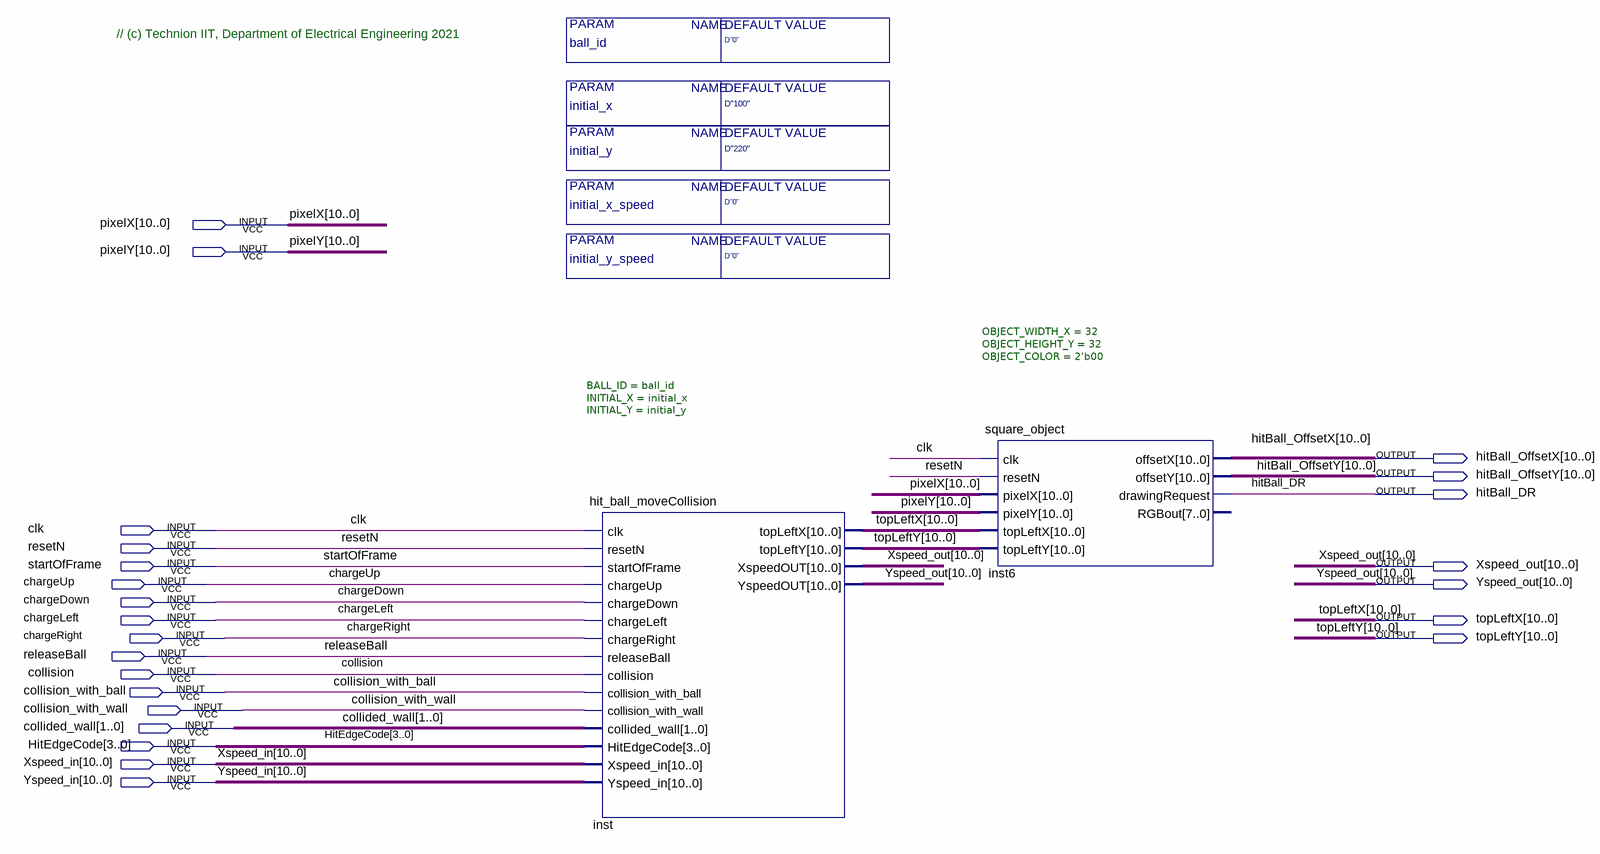
[diagram p0: schematic sheet]
// Quartus schematic HitBall_Block.bdf as structural Verilog: 2 symbols, 24 pins
module HitBall_Block #(parameter initial_x = "D\"100\"", parameter initial_y = "D\"220\"", parameter initial_x_speed = "D\"0\"", parameter initial_y_speed = "D\"0\"", parameter ball_id = "D\"0\"") (
  input  [10:0] pixelX,
  input  [10:0] pixelY,
  input  clk,
  input  resetN,
  input  startOfFrame,
  input  chargeUp,
  input  chargeDown,
  input  chargeLeft,
  input  chargeRight,
  input  releaseBall,
  input  collision,
  input  collision_with_ball,
  input  collision_with_wall,
  input  [1:0] collided_wall,
  input  [3:0] HitEdgeCode,
  input  [10:0] Xspeed_in,
  input  [10:0] Yspeed_in,
  output [10:0] hitBall_OffsetX,
  output [10:0] hitBall_OffsetY,
  output hitBall_DR,
  output [10:0] Xspeed_out,
  output [10:0] Yspeed_out,
  output [10:0] topLeftX,
  output [10:0] topLeftY
);

  hit_ball_moveCollision #(.BALL_ID(ball_id), .INITIAL_X(initial_x), .INITIAL_Y(initial_y)) inst (
    .clk(clk), .resetN(resetN), .startOfFrame(startOfFrame), .chargeUp(chargeUp), .chargeDown(chargeDown),
    .chargeLeft(chargeLeft), .chargeRight(chargeRight), .releaseBall(releaseBall), .collision(collision),
    .collision_with_ball(collision_with_ball), .collision_with_wall(collision_with_wall),
    .collided_wall(collided_wall), .HitEdgeCode(HitEdgeCode), .Xspeed_in(Xspeed_in), .Yspeed_in(Yspeed_in),
    .topLeftX(topLeftX), .topLeftY(topLeftY), .XspeedOUT(Xspeed_out), .YspeedOUT(Yspeed_out));
  square_object #(.OBJECT_WIDTH_X(32), .OBJECT_HEIGHT_Y(32), .OBJECT_COLOR(2'b00)) inst6 (
    .clk(clk), .resetN(resetN), .pixelX(pixelX), .pixelY(pixelY), .topLeftX(topLeftX), .topLeftY(topLeftY),
    .offsetX(hitBall_OffsetX), .offsetY(hitBall_OffsetY), .drawingRequest(hitBall_DR));  // open: RGBout

  // Notes on the sheet:
  //   // (c) Technion IIT, Department of Electrical Engineering 2021
endmodule
